# EAGLE schematic IBUS GPS BME Sensor v18 (EAGLE 9.7.0)
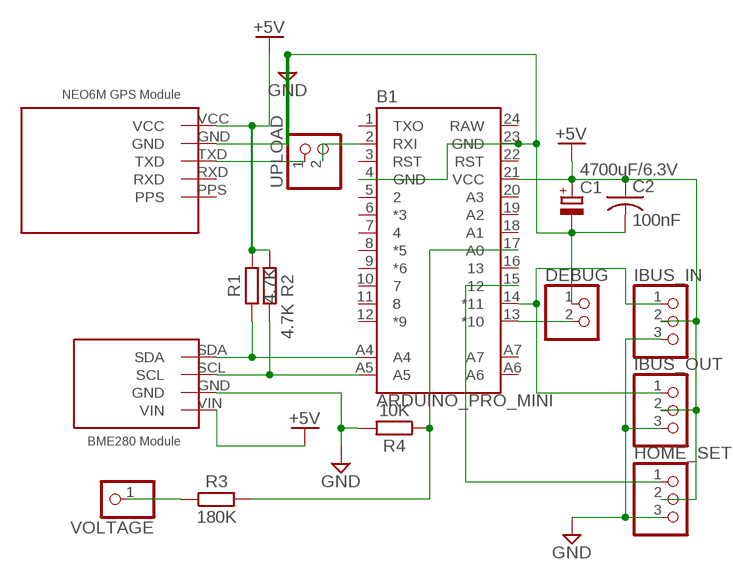
[diagram p0: schematic, sheet 1]

## Parts
B1  ARDUINO_PRO_MINI  [ARDUINO_PRO_MINI]
C1  4700uF/6.3V  C-POL_RADIAL-11MM-DIA  [CAPPRD508W65D1000H1100B]
C2  100nF  C-US025-024X044  [C025-024X044]
DEBUG  PINHD-1X2  [1X02]
HOME_SET  PINHD-1X3  [1X03]
IBUS_IN  PINHD-1X3  [1X03]
IBUS_OUT  PINHD-1X3  [1X03]
R1  4.7K  R-EU_0204/5  [0204/5]
R2  4.7K  R-EU_0204/5  [0204/5]
R3  180K  R-EU_0204/5  [0204/5]
R4  10K  R-EU_0204/5  [0204/5]
U1  BME280_MODULE_5V_STD  [BME280_MODULE_5V]
U2  NEO6M_GPS_MODULE  [NEO6M_GPS_MODULE]
UPLOAD  PINHD-1X2  [1X02]
VOLTAGE  PINHD-1X1  [1X01]

## Nets
+5V [PWR]: B1.21(VCC) C1.1(+) C2.1 HOME_SET.2 IBUS_IN.2 IBUS_OUT.2 R1.2 R2.2 U1.VIN U2.VCC
GND [GND]: B1.4(GND) B1.23(GND) C1.2(-) C2.2 DEBUG.1 HOME_SET.3 IBUS_IN.3 IBUS_OUT.3 R4.2 U1.GND U2.GND
IBUS: B1.14(*11) IBUS_IN.1 IBUS_OUT.1
N$2: B1.13(*10) DEBUG.2
N$3: B1.A4 R1.1 U1.SDA
N$4: B1.A5 R2.1 U1.SCL
N$5: U2.TXD UPLOAD.1
N$7: B1.2(RXI) UPLOAD.2
N$11: B1.15 HOME_SET.1
N$12: B1.17(A0) R3.2 R4.1
N$13: R3.1 VOLTAGE.1
Unconnected: B1.1(TXO) B1.3(RST) B1.5 B1.6(*3) B1.7 B1.8(*5) B1.9(*6) B1.10 B1.11 B1.12(*9) B1.16 B1.18(A1) B1.19(A2) B1.20(A3) B1.22(RST) B1.A6 B1.A7 U2.PPS U2.RXD

## Power pins joined to a net without a drawn wire
RAW: B1.24(RAW)

## Library data of the parts
B1 = SparkFun-Boards:ARDUINO_PRO_MINI: SparkFun Pro Mini Pro Mini compatible footprint. Dimensions: 0.7 x 1.3" PCB Thickness: 0.8mm SparkFun Products: 3.3V/8MHz <https://www.sparkfun.com/products/11114> 5V/16MHz <https://www.sparkfun.com/products/11113>
C1 = Capacitor:C-POL: Capacitor Polarised - Generic; CATEGORY: Capacitor
C2 = rcl:C-US: CAPACITOR, American symbol; SPICEPREFIX: C
DEBUG UPLOAD = pinhead:PINHD-1X2: PIN HEADER
HOME_SET IBUS_IN IBUS_OUT = pinhead:PINHD-1X3: PIN HEADER
R1-R4 = rcl:R-EU_: RESISTOR, European symbol; SPICEPREFIX: R
U1 = BME280_Module_5V:BME280_MODULE_5V: BME280/BMP280 5 V I²C breakout (VIN,GND,SCL,SDA), 15×11 mm, outline tDocu(51)
U2 = NEO-6M-7M:NEO6M_GPS_MODULE
VOLTAGE = pinhead:PINHD-1X1: PIN HEADER